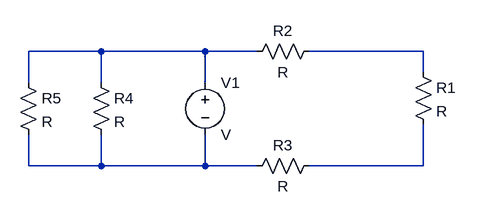
[diagram p0: schematic Draft1.asc]
Draft1.asc, the LTspice schematic file:
Version 4
SHEET 1 880 680
WIRE -144 96 -256 96
WIRE 16 96 -144 96
WIRE 96 96 16 96
WIRE 352 96 176 96
WIRE 352 128 352 96
WIRE -256 144 -256 96
WIRE -144 144 -144 96
WIRE 16 144 16 96
WIRE -256 272 -256 224
WIRE -144 272 -144 224
WIRE -144 272 -256 272
WIRE 16 272 16 224
WIRE 16 272 -144 272
WIRE 96 272 16 272
WIRE 352 272 352 208
WIRE 352 272 176 272
SYMBOL res 336 112 R0
SYMATTR InstName R1
SYMBOL res 80 112 R270
WINDOW 0 32 56 VTop 2
WINDOW 3 0 56 VBottom 2
SYMATTR InstName R2
SYMBOL res 80 288 R270
WINDOW 0 32 56 VTop 2
WINDOW 3 0 56 VBottom 2
SYMATTR InstName R3
SYMBOL voltage 16 128 R0
SYMATTR InstName V1
SYMBOL res -160 128 R0
SYMATTR InstName R4
SYMBOL res -272 128 R0
SYMATTR InstName R5

The netlist it stands for:
* Draft1.asc
R1 N002 N004 R
R2 N001 N002 R
R3 N003 N004 R
V1 N001 N003 V
R4 N001 N003 R
R5 N001 N003 R
.backanno
.end